# EAGLE design BoschPumpDriver (EAGLE 8.2.2)
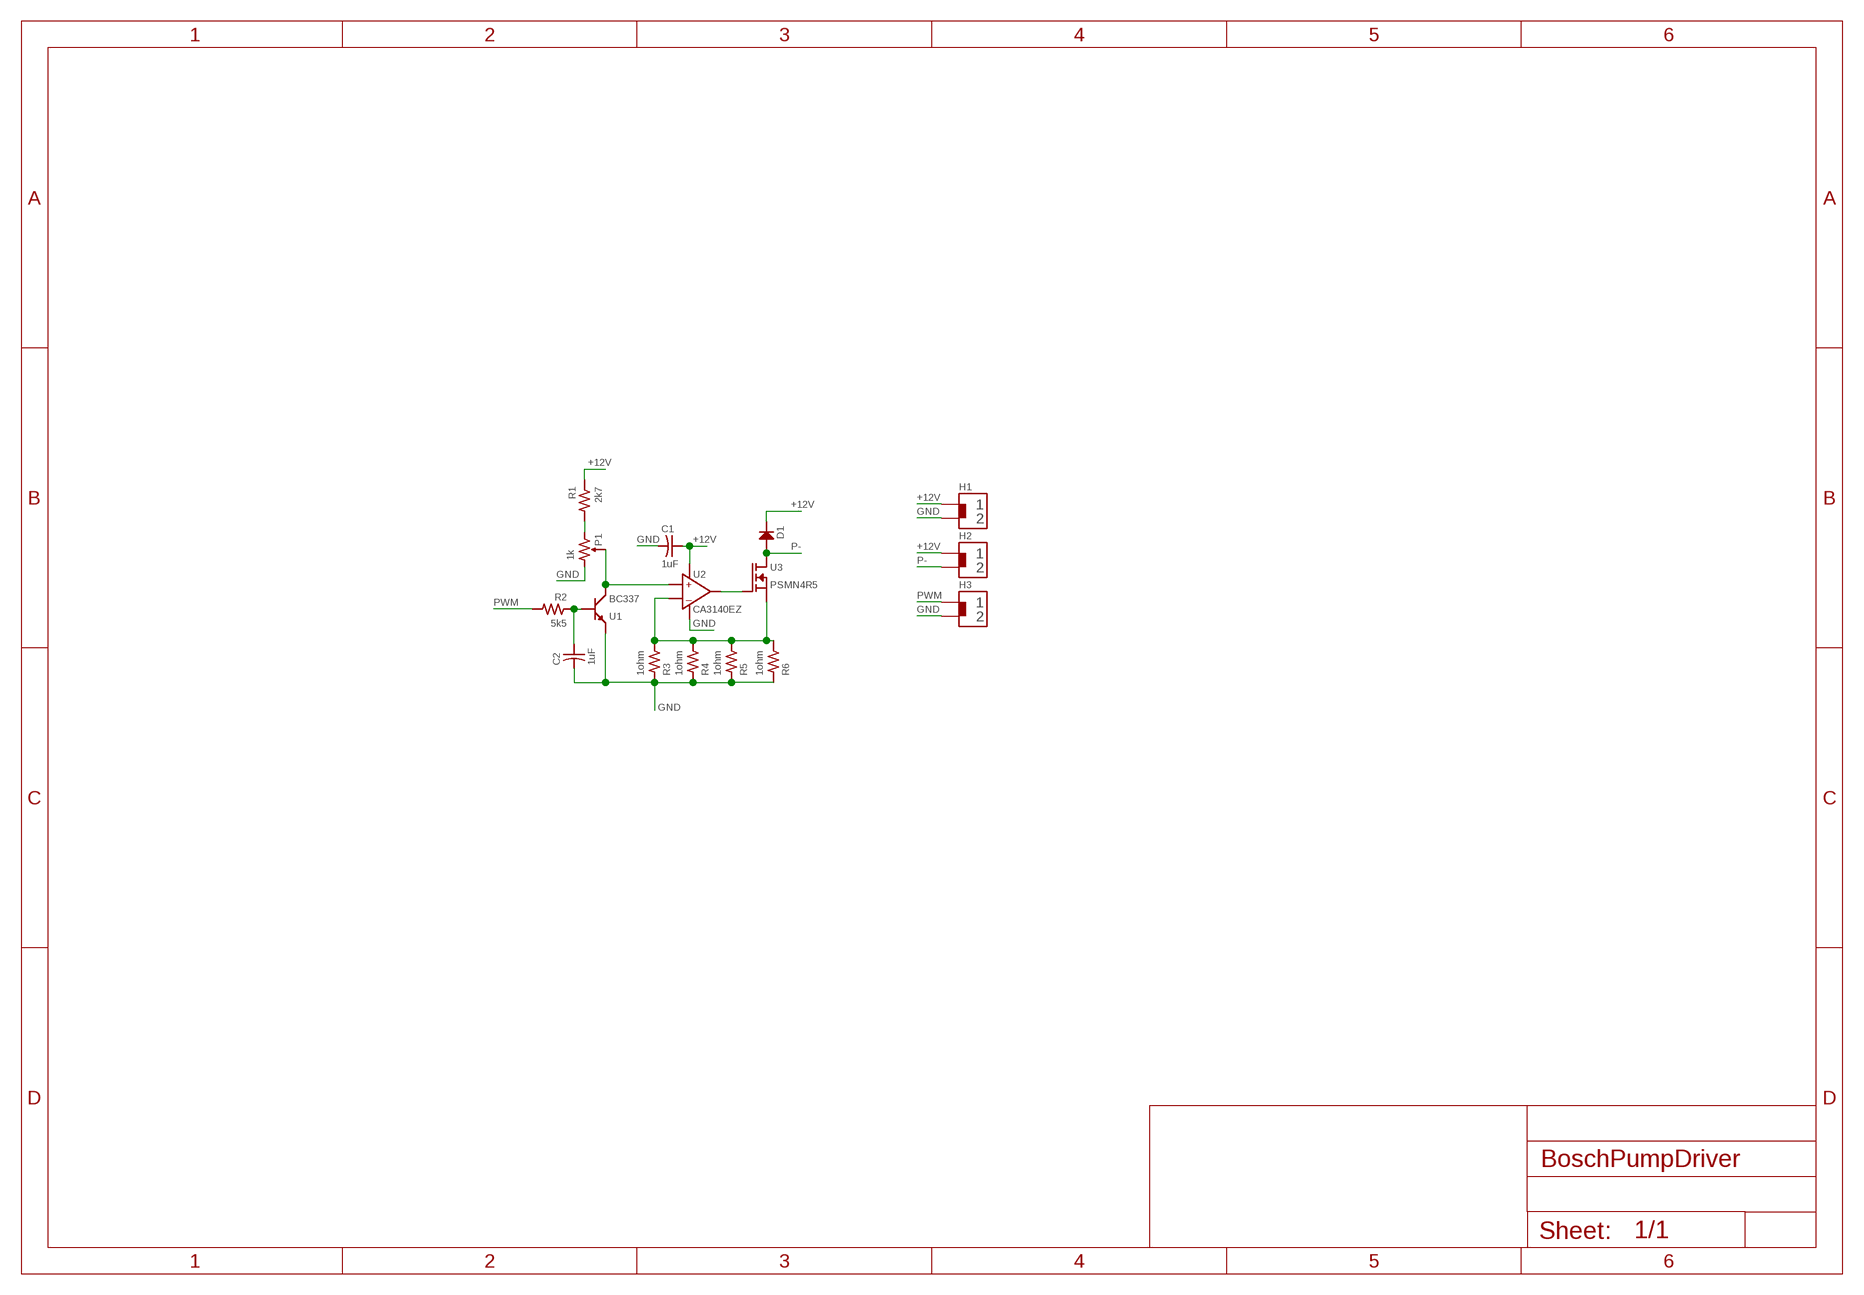
[diagram p0: schematic, sheet 1]

## Parts
C1  1uF  CTH  [CRS100NF]
C2  1uF  CTH  [CRS100NF]
D1  DIODEVERT  [R_VERT]
H1  VCC  HEADER2PINPAD_ROUND  [HEADER2PIN]
H2  PUMP  HEADER2PINPAD_ROUND  [HEADER2PIN]
H3  PWM  HEADER2PINPAD_ROUND  [HEADER2PIN]
P1  1k  POTENTIOMETER2.54_3PIN  [3PIN_POT_2.54]
R1  2k7  RORR  [R1/4TH]
R2  5k5  RVERT  [R_VERT]
R3  1ohm  RVERT  [R_VERT]
R4  1ohm  RVERT  [R_VERT]
R5  1ohm  RVERT  [R_VERT]
R6  1ohm  RVERT  [R_VERT]
U1  BC337  BJT_NPNBC337  [TO92]
U2  CA3140EZ  OPAMP_1CA3140EZ_PDIP8  [DIP8]
U3  PSMN4R5  MOSFET_NPSMN4R5  [TO-220]

## Nets
+12V: C1.+ D1.2(OUT) H1.1 H2.1 R1.P$1 U2.7(VCC+)
GND: C1.- C2.- H1.2 H3.2 P1.1 R3.1 R4.1 R5.1 R6.1 U1.3(E) U2.4(VCC-)
N$1: U2.6(OUT) U3.1(G)
N$2: P1.2 U1.1(C) U2.3(IN+)
N$3: C2.+ R2.1 U1.2(B)
N$4: R3.2 R4.2 R5.2 R6.2 U2.2(IN-) U3.3(S)
N$6: P1.3 R1.P$2
P-: D1.1(IN) H2.2 U3.2(D)
PWM: H3.1 R2.2

## Library data of the parts
C1 C2 = Gisa:C
D1 = Gisa:DIODE
H1-H3 = Gisa:HEADER2PIN
P1 = Gisa:POTENTIOMETER
R1-R6 = Gisa:R
U1 = Gisa:BJT_NPN
U2 = Gisa:OPAMP_1
U3 = Gisa:MOSFET_N

## Board
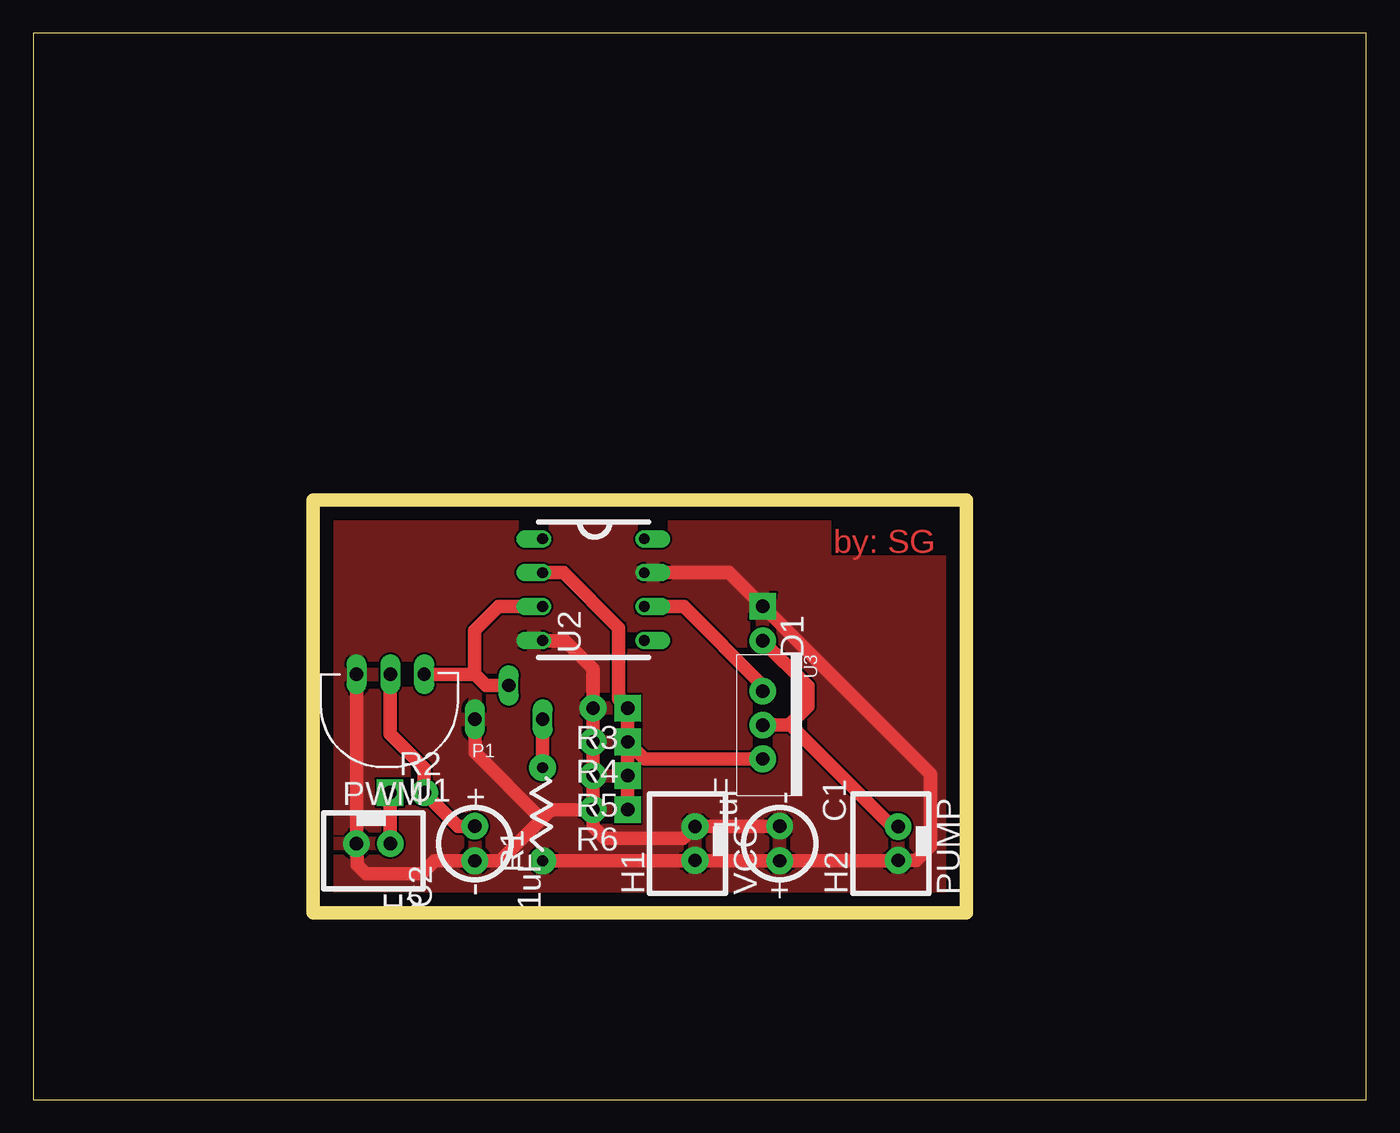
[diagram p1: board, top side]

Size 100 x 80 mm. Coordinates in mm from the lower left corner, seen from the top.
Outline: 0,0 100,0 100,80 0,80 0,0
Outline: 21,14 70,14 70,45 21,45 21,14
Copper layers (1*16): Top 0.035mm / dielectric 1.5mm / Bottom 0.035mm
Design rules "default": minimum track width 6mil, minimum drill 0.35mm, track to track 6mil, track to pad 6mil, pad to pad 6mil, via to via 6mil, smd to smd 6mil, copper to edge 40mil, drill to drill 6mil, minimum pad ring 10mil, minimum via ring 8mil, stop-mask expansion 4mil, vias tented up to drill 0mil, thermal gap 10mil

### Footprints (pad centres in the part's own frame; a part is rotated, then mirrored left to right if it is on the bottom)
CRS100NF = drill 1 pad 2: + 1.3,0; - -1.3,0
R_VERT = drill 1 pad 2: 1 -1.3,0 | drill 1 pad 2 square: 2 1.3,0
HEADER2PIN = drill 1 pad 2: 1 -1.27,0; 2 1.27,0
3PIN_POT_2.54 = drill 1 long: 1 -2.54,0; 2 0,2.54; 3 2.54,0
R1/4TH = drill 0.8 pad 2: P$1 -3.5,0; P$2 3.5,0
TO92 = drill 1 long: 1 -2.54,0; 2 0,0; 3 2.54,0
DIP8 = drill 0.8 offset: 1 -3.81,3.81; 2 -3.81,1.27; 3 -3.81,-1.27; 4 -3.81,-3.81; 5 3.81,-3.81; 6 3.81,-1.27; 7 3.81,1.27; 8 3.81,3.81
TO-220 = drill 1 pad 2: 1 -2.54,0; 2 0,0; 3 2.54,0

### Placement (x,y rotation side)
C1  55.99,19.21 270 top
C2  33.13,19.21 90 top
D1  54.72,35.72 90 top
H1  49.64,19.21 90 top
H2  64.88,19.21 90 top
H3  25.51,19.21 180 top
P1  35.67,28.53 0 top
R1  38.21,21.41 90 top
R2  28.05,23.02 180 top
R3  43.29,29.37 0 top
R4  43.29,26.83 0 top
R5  43.29,24.29 0 top
R6  43.29,21.75 0 top
U1  26.78,31.91 180 top
U2  42.02,38.26 0 top
U3  54.72,28.1 270 top

### Tracks (layer width: path | path; a pad name or v marks a point on that pad's centre or on a via)
+12V
  Top 1.016: U2.7 52.21,39.53 D1.2 67.3,24.44 67.3,19 66.24,17.94 H2.1 64.85,17.91 C1.+ 49.67,17.91 H1.1 49.61,17.91 R1.P$1
  pour Top: 22,44 69,44 69,15 22,15
GND
  Top 1.016: C1.- 55.96,20.48 H1.2 48.76,19.6 42.9,19.6 41.99,20.51 R6.1 | R6.1 R5.1 R4.1 R3.1 41.99,32.31 39.9,34.4 38.26,34.4 U2.4 | U1.3 H3.2 24.3,19.15 24.3,17.6 24.98,16.92 29.12,16.92 30.11,17.91 C2.- 35,17.9 38.13,21.03 | R6.1 38.85,21.75 38.13,21.03 | P1.1 33.13,26.03 38.13,21.03
  pour Top: 22,44 69,44 69,15 22,15
N$1
  Top 1.016: U3.1 54.72,31.08 48.8,37 U2.6
N$2
  Top 1.016: 33.13,31.91 U1.1 | U2.3 34.89,36.99 33.1,35.2 33.1,31.94 33.13,31.91 | P1.2 33.97,31.07 33.13,31.91
N$3
  Top 1.016: C2.+ 31.86,20.51 R2.1 29.3,23.07 29.3,24.9 26.78,27.42 U1.2
N$4
  Top 1.016: U3.3 45.86,25.56 44.89,26.53 R4.2 | R4.2 R3.2 43.9,30.06 43.9,35.4 39.77,39.53 U2.2 | R4.2 R5.2 R6.2
N$6
  Top 1.016: P1.3 R1.P$2
P-
  Top 1.016: H2.2 64.42,20.48 56.8,28.1 U3.2 56.7,28.1 58.1,29.5 58.1,31.04 D1.1
PWM
  Top 1.016: R2.2 26.75,19.24 H3.1

### Text on the board
Top: by: SG